# Altium schematic sheet Function Block Diagram.SchDoc
size A4; SheetNumber: 1; SheetTotal: 2
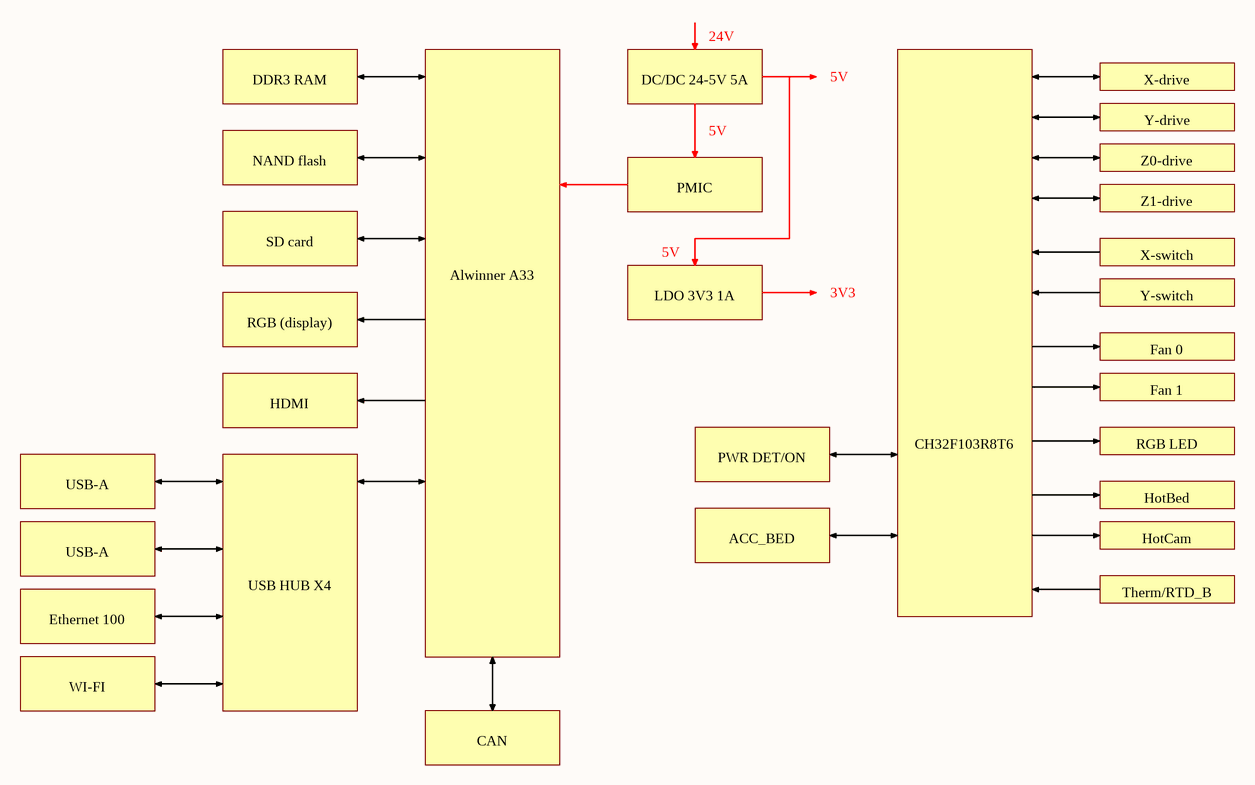
[diagram p0: Function Block Diagram.SchDoc]

## Notes on the sheet
- 24V
- DDR3 RAM
- DC/DC 24-5V 5A
- 5V
- X-drive
- Y-drive
- Z0-drive
- NAND flash
- PMIC
- Z1-drive
- SD card
- 3V3
- X-switch
- Y-switch
- RGB (display)
- LDO 3V3 1A
- Fan 0
- HDMI
- Fan 1
- USB-A
- PWR DET/ON
- RGB LED
- HotBed
- ACC_BED
- HotCam
- Ethernet 100
- CH32F103R8T6
- Therm/RTD_B
- WI-FI
- USB HUB X4
- Alwinner A33
- CAN